# Altium schematic sheet Arduino mega shield.SchDoc
size A4; SheetNumber: 4; SheetTotal: 4
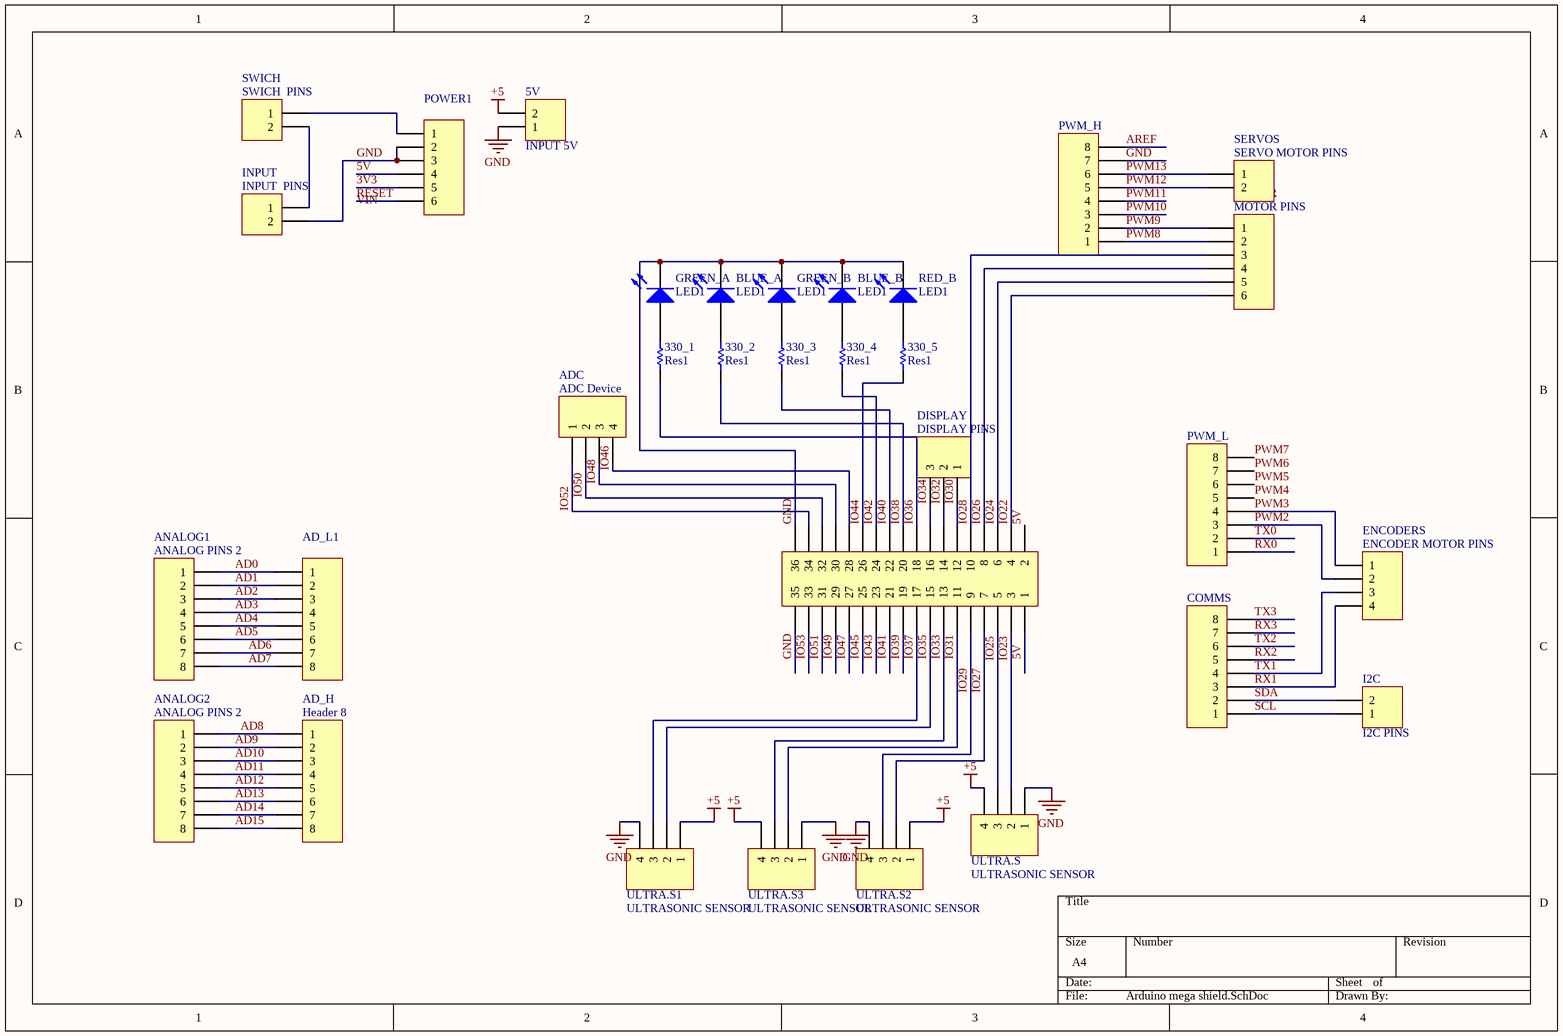
[diagram p0: Arduino mega shield.SchDoc]

## Parts
5V  INPUT 5V  [HDR1X2]
330_1  Res1  [AXIAL-0.3]
330_2  Res1  [AXIAL-0.3]
330_3  Res1  [AXIAL-0.3]
330_4  Res1  [AXIAL-0.3]
330_5  Res1  [AXIAL-0.3]
AD_H  Header 8  [HDR1X8]
AD_L1  Header 8  [HDR1X8]  (value not drawn)
ADC  ADC Device  [HDR1X4]
ANALOG1  ANALOG PINS 2  [HDR1X8]
ANALOG2  ANALOG PINS 2  [HDR1X8]
BLUE_A  LED1  [LED-1]
BLUE_B  LED1  [LED-1]
COMMS  Header 8  [HDR1X8]  (value not drawn)
DISPLAY  DISPLAY PINS  [HDR1X3]
ENCODERS  ENCODER MOTOR PINS  [HDR1X4]
GREEN_A  LED1  [LED-1]
GREEN_B  LED1  [LED-1]
I2C  I2C PINS  [HDR1X2]
INPUT  INPUT  PINS  [HDR1X2]
MOTOR  MOTOR PINS  [HDR1X6]
POWER1  Header 6  [HDR1X6]  (value not drawn)
PWM_H  Header 8  [HDR1X8]  (value not drawn)
PWM_L  Header 8  [HDR1X8]  (value not drawn)
RED_B  LED1  [LED-1]
SERVOS  SERVO MOTOR PINS  [HDR1X2]
SWICH  SWICH  PINS  [HDR1X2]
ULTRA.S  ULTRASONIC SENSOR  [HDR1X4]
ULTRA.S1  ULTRASONIC SENSOR  [HDR1X4]
ULTRA.S2  ULTRASONIC SENSOR  [HDR1X4]
ULTRA.S3  ULTRASONIC SENSOR  [HDR1X4]
  Header 18X2  [HDR2X18]  (value not drawn)

## Nets
+5: 5V.2 ULTRA.S.4 ULTRA.S1.1 ULTRA.S2.1 ULTRA.S3.4
GND: 5V.1 BLUE_A.2(K) BLUE_B.2(K) GREEN_A.2(K) GREEN_B.2(K) INPUT.2 POWER1.2 POWER1.3 PWM_H.7 RED_B.2(K) ULTRA.S.1 ULTRA.S1.4 ULTRA.S2.4 ULTRA.S3.1 .35 .36
3V3: POWER1.5
5V: POWER1.4 .1 .2
AD0: AD_L1.1 ANALOG1.1
AD1: AD_L1.2 ANALOG1.2
AD2: AD_L1.3 ANALOG1.3
AD3: AD_L1.4 ANALOG1.4
AD4: AD_L1.5 ANALOG1.5
AD5: AD_L1.6 ANALOG1.6
AD6: AD_L1.7 ANALOG1.7
AD7: AD_L1.8 ANALOG1.8
AD8: AD_H.1 ANALOG2.1
AD9: AD_H.2 ANALOG2.2
AD10: AD_H.3 ANALOG2.3
AD11: AD_H.4 ANALOG2.4
AD12: AD_H.5 ANALOG2.5
AD13: AD_H.6 ANALOG2.6
AD14: AD_H.7 ANALOG2.7
AD15: AD_H.8 ANALOG2.8
AREF: PWM_H.8
IO22: MOTOR.6 .4
IO23: ULTRA.S.2 .3
IO24: MOTOR.5 .6
IO25: ULTRA.S.3 .5
IO26: MOTOR.4 .8
IO27: ULTRA.S2.2 .7
IO28: MOTOR.3 .10
IO29: ULTRA.S2.3 .9
IO30: DISPLAY.1 .12
IO31: ULTRA.S3.2 .11
IO32: DISPLAY.2 .14
IO33: ULTRA.S3.3 .13
IO34: DISPLAY.3 .16
IO35: ULTRA.S1.2 .15
IO36: 330_1.2 .18
IO37: ULTRA.S1.3 .17
IO38: 330_2.2 .20
IO39: .19
IO40: 330_3.2 .22
IO41: .21
IO42: 330_4.2 .24
IO43: .23
IO44: 330_5.2 .26
IO45: .25
IO46: ADC.4 .28
IO47: .27
IO48: ADC.3 .30
IO49: .29
IO50: ADC.2 .32
IO51: .31
IO52: ADC.1 .34
IO53: .33
PWM2: ENCODERS.2 PWM_L.3
PWM3: ENCODERS.1 PWM_L.4
PWM4: PWM_L.5
PWM5: PWM_L.6
PWM6: PWM_L.7
PWM7: PWM_L.8
PWM8: MOTOR.2 PWM_H.1
PWM9: MOTOR.1 PWM_H.2
PWM10: PWM_H.3
PWM11: PWM_H.4
PWM12: PWM_H.5 SERVOS.2
PWM13: PWM_H.6 SERVOS.1
RESET: POWER1.6
RX0: PWM_L.1
RX1: COMMS.3 ENCODERS.4
RX2: COMMS.5
RX3: COMMS.7
SCL: COMMS.1 I2C.1
SDA: COMMS.2 I2C.2
TX0: PWM_L.2
TX1: COMMS.4 ENCODERS.3
TX2: COMMS.6
TX3: COMMS.8
Net330_1_1: 330_1.1 GREEN_A.1(A)
Net330_2_1: 330_2.1 BLUE_A.1(A)
Net330_3_1: 330_3.1 GREEN_B.1(A)
Net330_4_1: 330_4.1 BLUE_B.1(A)
Net330_5_1: 330_5.1 RED_B.1(A)
NetINPUT_1: INPUT.1 SWICH.2
NetPOWER1_1: POWER1.1 SWICH.1

## Notes on the sheet
- Labels drawn without touching a wire or pin: VIN

## Library data of the parts
5V I2C INPUT SERVOS SWICH = Header 2: Header, 2-Pin; LatestRevisionDate: 17-Jul-2002; LatestRevisionNote: Re-released for DXP Platform.; Publisher: Altium Limited
330_1-330_5 = Res1: Resistor; Published: 8-Jun-2000; LatestRevisionDate: 17-Jul-2002; LatestRevisionNote: Re-released for DXP Platform.; PackageReference: AXIAL-0.3; Publisher: Altium Limited; PackageDescription: Axial Device, Thru-Hole; 2 Leads; 0.3 in Pin Spacing
AD_H AD_L1 ANALOG1 ANALOG2 COMMS PWM_H PWM_L = Header 8: Header, 8-Pin; LatestRevisionDate: 17-Jul-2002; LatestRevisionNote: Re-released for DXP Platform.; Publisher: Altium Limited
ADC ENCODERS ULTRA.S ULTRA.S1-ULTRA.S3 = Header 4: Header, 4-Pin; LatestRevisionDate: 17-Jul-2002; LatestRevisionNote: Re-released for DXP Platform.; Publisher: Altium Limited
BLUE_A BLUE_B GREEN_A GREEN_B RED_B = LED1: Typical RED GaAs LED; Published: 8-Jun-2000; LatestRevisionDate: 08-Jul-2005; LatestRevisionNote: Mech Layer 1 removed.; PackageReference: LED-1; Publisher: Altium Limited; PackageDescription: LED; 2 Leads
DISPLAY = Header 3: Header, 3-Pin; LatestRevisionDate: 17-Jul-2002; LatestRevisionNote: Re-released for DXP Platform.; Publisher: Altium Limited
MOTOR POWER1 = Header 6: Header, 6-Pin; LatestRevisionDate: 17-Jul-2002; LatestRevisionNote: Re-released for DXP Platform.; Publisher: Altium Limited
 = Header 18X2: Header, 18-Pin, Dual row; LatestRevisionDate: 17-Jul-2002; LatestRevisionNote: Re-released for DXP Platform.; Publisher: Altium Limited